# Altium schematic sheet LPCB224 - CAN.SchDoc
size A3; Address1: Factory 10; Address2: 9-13 Dingley Avenue, Dandeong, VICTORIA 3175, AUSTRALIA; DocumentNumber: 2; Revision: 1; SheetNumber: 2; SheetTotal: 7; Lockie__PCB_SUB_ASSEMBLY: CAN Interface; Lockie__PCB_ASSEMBLY: Core Node; Lockie__LDL: LPCB224; Lockie__PCB_DESCRIPTION: Core Node
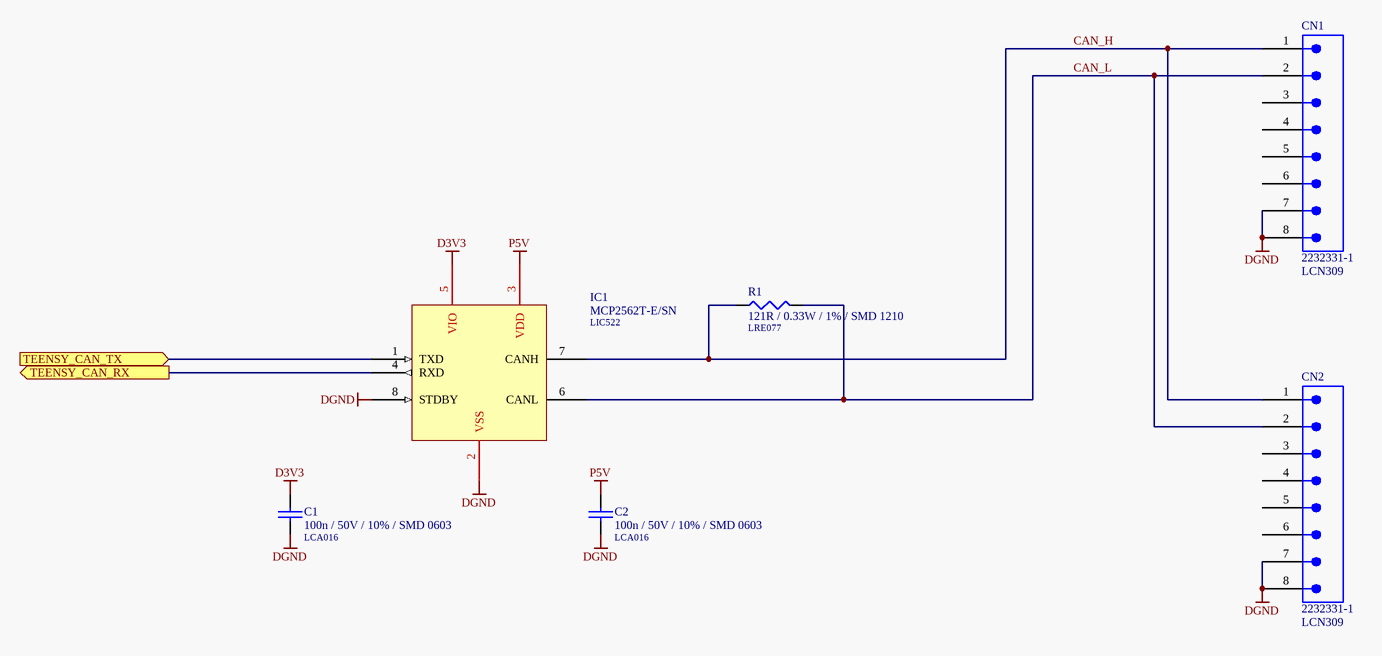
[diagram p0: LPCB224 - CAN.SchDoc]

## Parts
C1  100n / 50V / 10% / SMD 0603  LDL_NUMBER: LCA016  [LFP011__CC1608-0603-IPC7351_B]
C2  100n / 50V / 10% / SMD 0603  LDL_NUMBER: LCA016  [LFP011__CC1608-0603-IPC7351_B]
CN1  2232331-1  LDL_NUMBER: LCN309  [2232331-1]
CN2  2232331-1  LDL_NUMBER: LCN309  [2232331-1]
IC1  MCP2562T-E/SN  LDL_NUMBER: LIC522  [LFP017__SO-G8/Y1.9]
R1  121R / 0.33W / 1% / SMD 1210  LDL_NUMBER: LRE077  [LFP028__CR3225-1210]

## Ports
TEENSY_CAN_RX (out), TEENSY_CAN_TX (in)

## Nets
D3V3: C1.1 IC1.5(VIO)
DGND: C1.2 C2.2 CN1.7 CN1.8 CN2.7 CN2.8 IC1.2(VSS) IC1.8(STDBY)
P5V: C2.1 IC1.3(VDD)
CAN_H: CN1.1 CN2.1 IC1.7(CANH) R1.1
CAN_L: CN1.2 CN2.2 IC1.6(CANL) R1.2
TEENSY_CAN_RX: IC1.4(RXD) ; port TEENSY_CAN_RX
TEENSY_CAN_TX: IC1.1(TXD) ; port TEENSY_CAN_TX

Not connected (* = marked no-connect by the designer): CN1 3 4 5 6; CN2 3 4 5 6

## Notes on the sheet
- PCB COMPONENT DESCRIPTION
- LDL NUMBER
- Assembly Details
- Size
- Drawing File Name
- Revision
- http://rloop.org
- Scale
- A3
- Sheet Details
- N.T.S
- Sheet:
- Of:

## Library data of the parts
C1 C2 = 100n / 50V / 10% / SMD 0603: Capacitor, Ceramic Chip, 100nF (0.1uF), 50V, 5%, SMD 0603 [LCA016]; FMEDA__OPERATING__VOLTAGE_MIN: 0; FMEDA__OPERATING__VOLTAGE_MAX: 3.3; FMEDA__OPERATING__TEMP_MIN: -20; FMEDA__OPERATING__TEMP_TYP: 27; FMEDA__OPERATING__TEMP_MAX: 50; FMEDA__CHANNEL: COM; Value: 100n; FMEDA__FUNCTION_IN_SYSTEM: *; FMEDA__OPERATING__VOLTAGE_TYP: 3.3
CN1 CN2 = 2232331-1: Connector, M12 8 Way, PCB Mount; FMEDA__CHANNEL: COM; FMEDA__OPERATING__CURRENT_MAX: 0; FMEDA__OPERATING__TEMP_MAX: 50; FMEDA__OPERATING__TEMP_MIN: -20; FMEDA__OPERATING__TEMP_TYP: 27; FMEDA__OPERATING__VOLTAGE_MAX: 16; FMEDA__OPERATING__VOLTAGE_TYP: 12; FMEDA__FUNCTION_IN_SYSTEM: *; FMEDA__OPERATING__CURRENT_MIN: 0; FMEDA__OPERATING__CURRENT_TYP: 0; FMEDA__OPERATING__VOLTAGE_MIN: 0
IC1 = MCP2562T-E/SN: IC, High Speed CAN Transceiver, SMD SOIC8 [LIC522]; FMEDA__OPERATING__TEMP_MAX: 50; FMEDA__OPERATING__TEMP_MIN: -20; FMEDA__OPERATING__TEMP_TYP: 27; FMEDA__OPERATING__VOLTAGE_MAX: 0; FMEDA__CHANNEL: COM; FMEDA__OPERATING__VOLTAGE_MIN: 0; FMEDA__OPERATING__VOLTAGE_TYP: 0; FMEDA__FUNCTION_IN_SYSTEM: *
R1 = 121R / 0.33W / 1% / SMD 1210: Resistor, Ceramic Chip, 121R, 0.33W, 1%, SMD 1210 [LRE077]; VALUE: 121; FMEDA__OPERATING__POWER_MAX: 0; FMEDA__OPERATING__TEMP_MAX: 50; FMEDA__OPERATING__TEMP_MIN: -20; FMEDA__OPERATING__TEMP_TYP: 27; FMEDA__CHANNEL: COM; FMEDA__OPERATING__POWER_MIN: 0; FMEDA__OPERATING__VOLTAGE_MAX: 0; FMEDA__OPERATING__VOLTAGE_MIN: 0; FMEDA__OPERATING__VOLTAGE_TYP: 0; FMEDA__FUNCTION_IN_SYSTEM: *